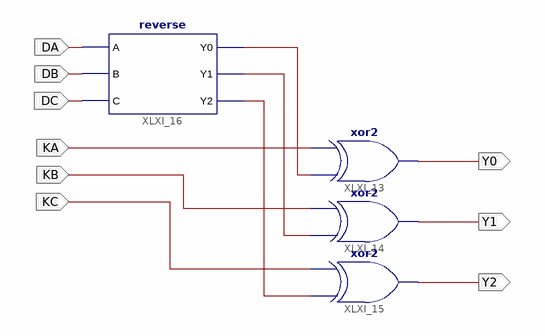
[diagram p0: schematic sheet 1]
// Xilinx ISE schematic encrypt.sch (zynq) as structural Verilog: 4 symbols, 9 ports
module encrypt (
  input  KA,
  input  DA,
  input  DB,
  input  DC,
  input  KB,
  input  KC,
  output Y1,
  output Y2,
  output Y0
);

  wire XLXN_9, XLXN_10, XLXN_11;

  xor XLXI_14 (Y1, XLXN_10, KB);
  xor XLXI_15 (Y2, XLXN_9, KC);
  reverse XLXI_16 (.A(DA), .B(DB), .C(DC), .Y1(XLXN_10), .Y2(XLXN_9), .Y0(XLXN_11));
  xor XLXI_13 (Y0, XLXN_11, KA);
endmodule
